# Altium schematic sheet BACKPMAN21_CPU.SchDoc
size A3
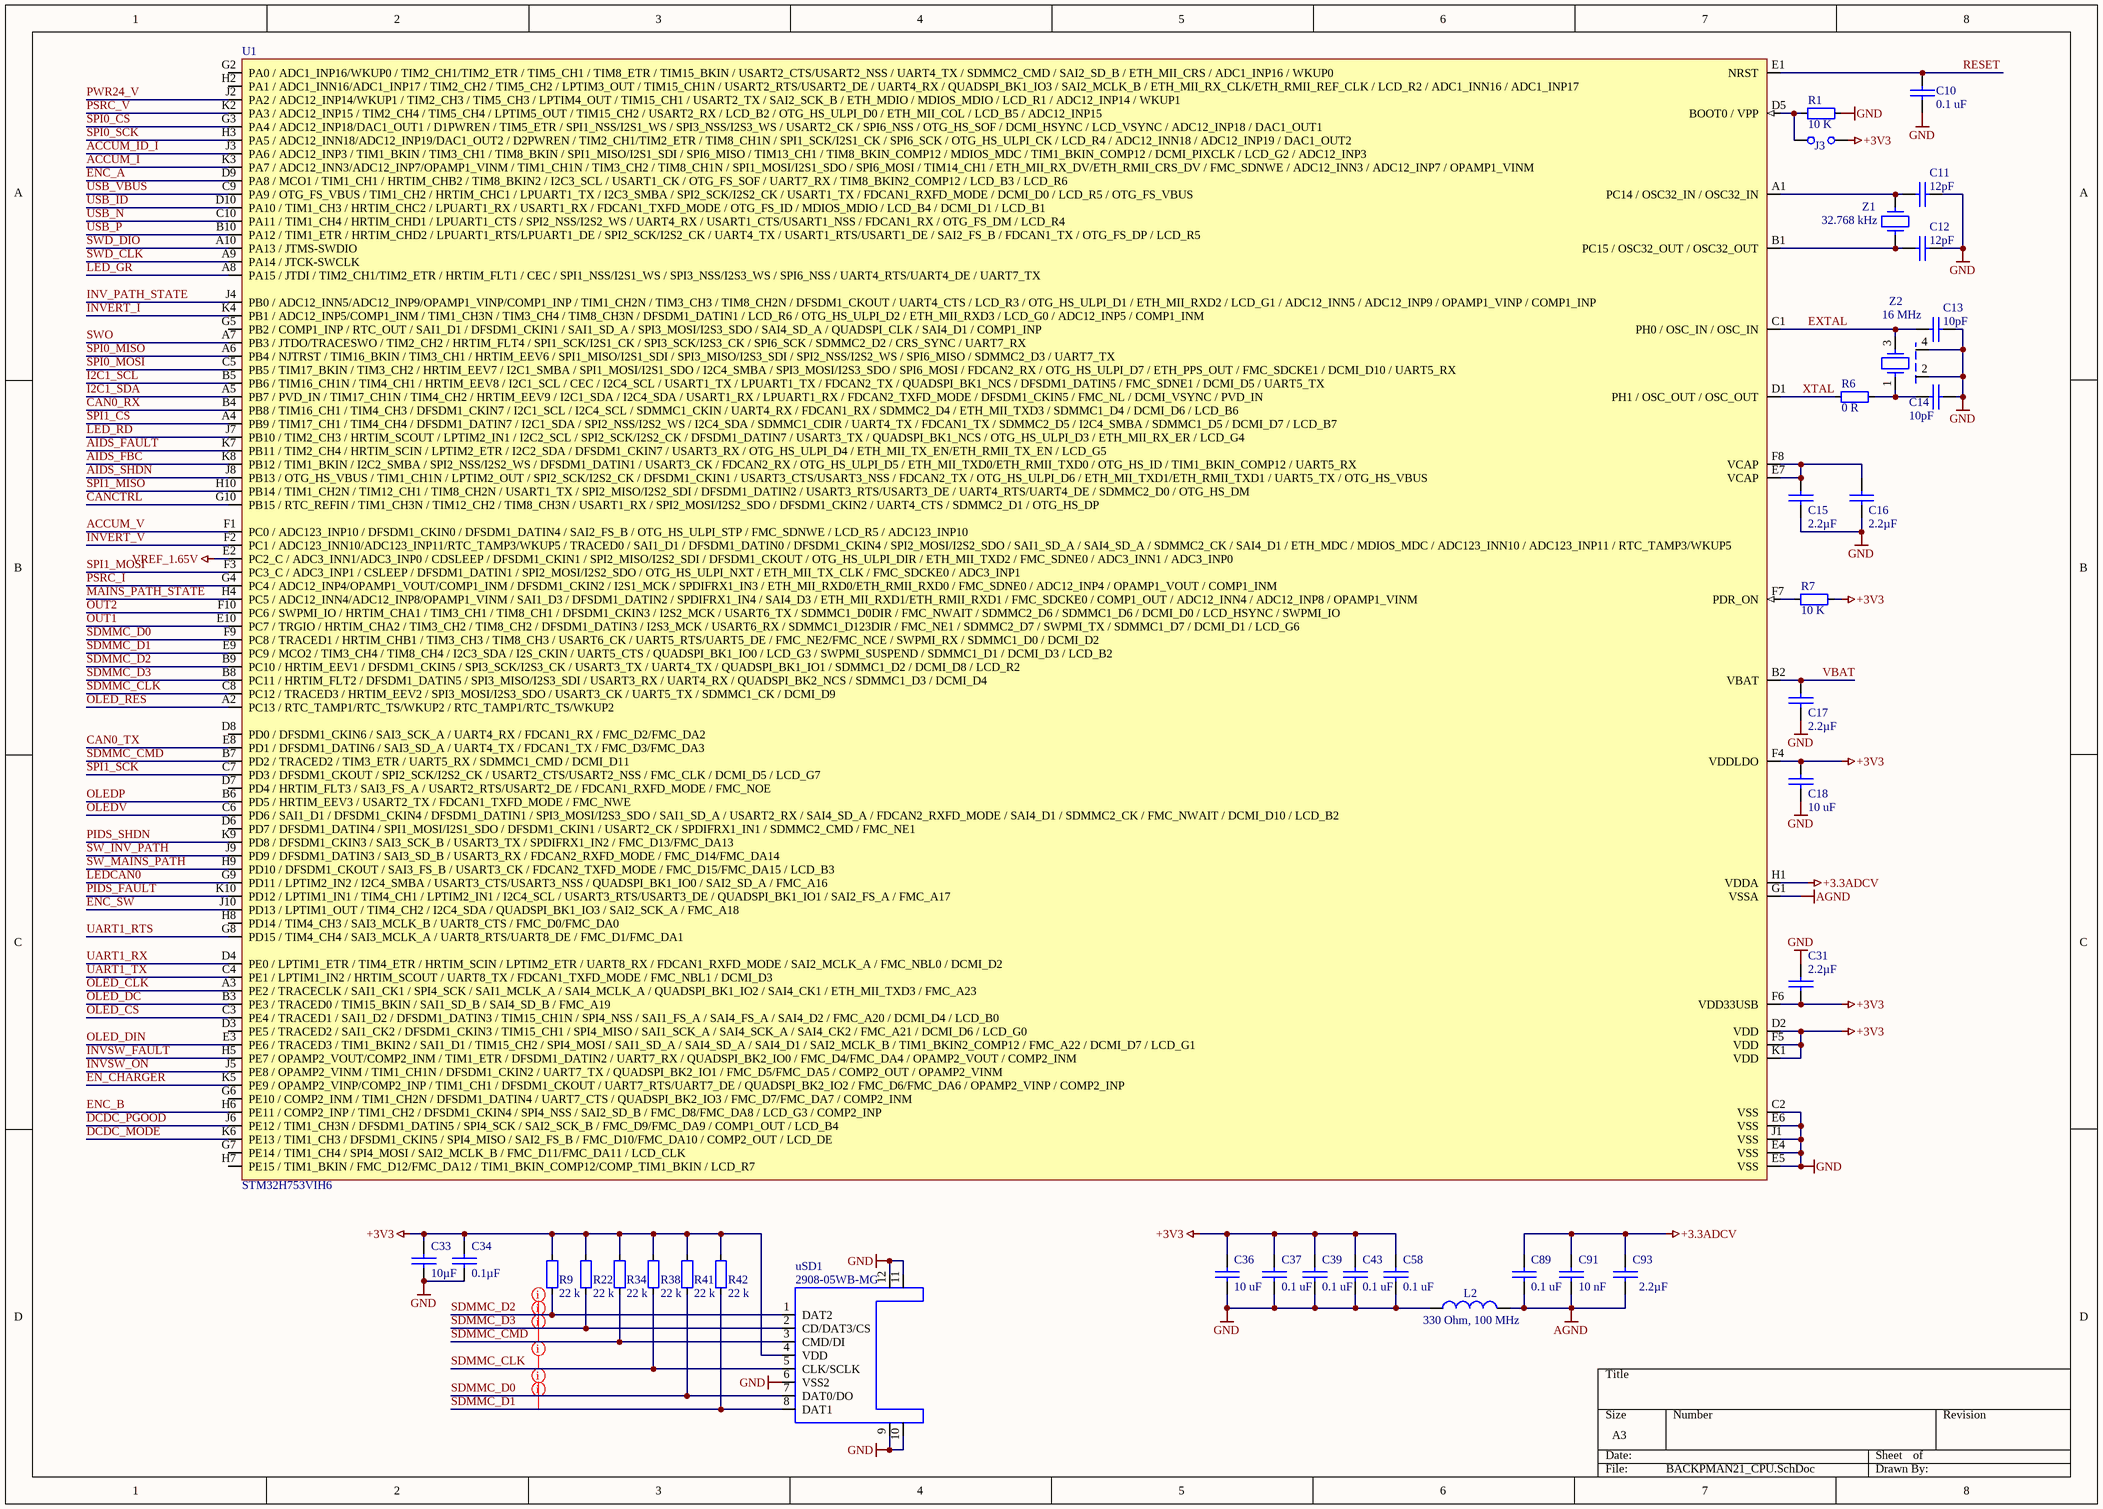
[diagram p0: BACKPMAN21_CPU.SchDoc]

## Parts
C10  value 0.1 uF  [1608[0603]]  (hidden comment: CL10B104KA8NNND)
C11  value 12pF  [0402 CAP]  (hidden comment: Capacitor)
C12  value 12pF  [0402 CAP]  (hidden comment: Capacitor)
C13  value 10pF  [0402 CAP]  (hidden comment: Capacitor)
C14  value 10pF  [0402 CAP]  (hidden comment: Capacitor)
C15  value 2.2µF  [0603 CAP]  (hidden comment: Capacitor)
C16  value 2.2µF  [0603 CAP]  (hidden comment: Capacitor)
C17  value 2.2µF  [0603 CAP]  (hidden comment: Capacitor)
C18  value 10 uF  [0805-1206]  (hidden comment: LMK212F106ZG-T)
C31  value 2.2µF  [0603 CAP]  (hidden comment: Capacitor)
C33  value 10µF  [0603 CAP]  (hidden comment: Capacitor)
C34  value 0.1µF  [0402 CAP]  (hidden comment: Capacitor)
C36  value 10 uF  [0805-1206]  (hidden comment: LMK212F106ZG-T)
C37  value 0.1 uF  [1608[0603]]  (hidden comment: CL10B104KA8NNND)
C39  value 0.1 uF  [1608[0603]]  (hidden comment: CL10B104KA8NNND)
C43  value 0.1 uF  [1608[0603]]  (hidden comment: CL10B104KA8NNND)
C58  value 0.1 uF  [1608[0603]]  (hidden comment: CL10B104KA8NNND)
C89  value 0.1 uF  [1608[0603]]  (hidden comment: CL10B104KA8NNND)
C91  value 10 nF  [1608[0603]]  (hidden comment: CVNF010K0603)
C93  value 2.2µF  [0603 CAP]  (hidden comment: Capacitor)
J3  PH1-02-TA-HT  [HDR1X2V]  (value not drawn)
L2  value 330 Ohm, 100 MHz  [0603]  (hidden comment: BLM18SG331TN1D)
R1  value 10 K  [0603]  (hidden comment: RL0603K010-1)
R6  value 0 R  [0603]  (hidden comment: RC0603FR-070RL)
R7  value 10 K  [0603]  (hidden comment: RL0603K010-1)
R9  value 22 k  [0402]  (hidden comment: Resistor)
R22  value 22 k  [0402]  (hidden comment: Resistor)
R34  value 22 k  [0402]  (hidden comment: Resistor)
R38  value 22 k  [0402]  (hidden comment: Resistor)
R41  value 22 k  [0402]  (hidden comment: Resistor)
R42  value 22 k  [0402]  (hidden comment: Resistor)
U1  STM32H753VIH6  [TFBGA100]
uSD1  2908-05WB-MG  [2908-05WB-MG]
Z1  value 32.768 kHz  [ABS7]  (hidden comment: ABS07-32.768KHZ-T)
Z2  value 16 MHz  [4-SMD 2.00mm x 1.60mm]  (hidden comment: ABM11-16.000MHZ-9-B1U-T)

## Nets
+3.3ADCV: C89.2 C91.1 C93.1 U1.H1(VDDA)
+3V3: C18.2 C31.2 C33.2 C34.2 C36.2 C37.2 C39.2 C43.2 C58.2 J3.2 R7.1 R9.2 R22.2 R34.2 R38.2 R41.2 R42.2 U1.D2(VDD) U1.F4(VDDLDO) U1.F5(VDD) U1.F6(VDD33USB) U1.K1(VDD) uSD1.4(VDD)
AGND: C89.1 C91.2 C93.2 L2.2 U1.G1(VSSA)
GND: C10.2 C11.2 C12.2 C13.2 C14.2 C15.2 C16.2 C17.2 C18.1 C31.1 C33.1 C34.1 C36.1 C37.1 C39.1 C43.1 C58.1 L2.1 R1.1 U1.C2(VSS) U1.E4(VSS) U1.E5(VSS) U1.E6(VSS) U1.J1(VSS) uSD1.6(VSS2) uSD1.9 uSD1.10(WP) uSD1.11(GND) uSD1.12(GND) Z2.2 Z2.4
VREF_1.65V: U1.E2(PC2_C_/_ADC3_INN1/ADC3_INP0_/_CDSLEEP_/_DFSDM1_CKIN1_/_SPI2_MISO/I2S2_SDI_/_DFSDM1_CKOUT_/_OTG_HS_ULPI_DIR_/_ETH_MII_TXD2_/_FMC_SDNE0_/_ADC3_INN1_/_ADC3_INP0)
ACCUM_I: U1.K3(PA7_/_ADC12_INN3/ADC12_INP7/OPAMP1_VINM_/_TIM1_CH1N_/_TIM3_CH2_/_TIM8_CH1N_/_SPI1_MOSI/I2S1_SDO_/_SPI6_MOSI_/_TIM14_CH1_/_ETH_MII_RX_DV/ETH_RMII_CRS_DV_/_FMC_SDNWE_/_ADC12_INN3_/_ADC12_INP7_/_OPAMP1_VINM)
ACCUM_ID_I: U1.J3(PA6_/_ADC12_INP3_/_TIM1_BKIN_/_TIM3_CH1_/_TIM8_BKIN_/_SPI1_MISO/I2S1_SDI_/_SPI6_MISO_/_TIM13_CH1_/_TIM8_BKIN_COMP12_/_MDIOS_MDC_/_TIM1_BKIN_COMP12_/_DCMI_PIXCLK_/_LCD_G2_/_ADC12_INP3)
ACCUM_V: U1.F1(PC0_/_ADC123_INP10_/_DFSDM1_CKIN0_/_DFSDM1_DATIN4_/_SAI2_FS_B_/_OTG_HS_ULPI_STP_/_FMC_SDNWE_/_LCD_R5_/_ADC123_INP10)
AIDS_FAULT: U1.K7(PB11_/_TIM2_CH4_/_HRTIM_SCIN_/_LPTIM2_ETR_/_I2C2_SDA_/_DFSDM1_CKIN7_/_USART3_RX_/_OTG_HS_ULPI_D4_/_ETH_MII_TX_EN/ETH_RMII_TX_EN_/_LCD_G5)
AIDS_FBC: U1.K8(PB12_/_TIM1_BKIN_/_I2C2_SMBA_/_SPI2_NSS/I2S2_WS_/_DFSDM1_DATIN1_/_USART3_CK_/_FDCAN2_RX_/_OTG_HS_ULPI_D5_/_ETH_MII_TXD0/ETH_RMII_TXD0_/_OTG_HS_ID_/_TIM1_BKIN_COMP12_/_UART5_RX)
AIDS_SHDN: U1.J8(PB13_/_OTG_HS_VBUS_/_TIM1_CH1N_/_LPTIM2_OUT_/_SPI2_SCK/I2S2_CK_/_DFSDM1_CKIN1_/_USART3_CTS/USART3_NSS_/_FDCAN2_TX_/_OTG_HS_ULPI_D6_/_ETH_MII_TXD1/ETH_RMII_TXD1_/_UART5_TX_/_OTG_HS_VBUS)
CAN0_RX: U1.B4(PB8_/_TIM16_CH1_/_TIM4_CH3_/_DFSDM1_CKIN7_/_I2C1_SCL_/_I2C4_SCL_/_SDMMC1_CKIN_/_UART4_RX_/_FDCAN1_RX_/_SDMMC2_D4_/_ETH_MII_TXD3_/_SDMMC1_D4_/_DCMI_D6_/_LCD_B6)
CAN0_TX: U1.E8(PD1_/_DFSDM1_DATIN6_/_SAI3_SD_A_/_UART4_TX_/_FDCAN1_TX_/_FMC_D3/FMC_DA3)
CANCTRL: U1.G10(PB15_/_RTC_REFIN_/_TIM1_CH3N_/_TIM12_CH2_/_TIM8_CH3N_/_USART1_RX_/_SPI2_MOSI/I2S2_SDO_/_DFSDM1_CKIN2_/_UART4_CTS_/_SDMMC2_D1_/_OTG_HS_DP)
DCDC_MODE: U1.K6(PE13_/_TIM1_CH3_/_DFSDM1_CKIN5_/_SPI4_MISO_/_SAI2_FS_B_/_FMC_D10/FMC_DA10_/_COMP2_OUT_/_LCD_DE)
DCDC_PGOOD: U1.J6(PE12_/_TIM1_CH3N_/_DFSDM1_DATIN5_/_SPI4_SCK_/_SAI2_SCK_B_/_FMC_D9/FMC_DA9_/_COMP1_OUT_/_LCD_B4)
EN_CHARGER: U1.K5(PE9_/_OPAMP2_VINP/COMP2_INP_/_TIM1_CH1_/_DFSDM1_CKOUT_/_UART7_RTS/UART7_DE_/_QUADSPI_BK2_IO2_/_FMC_D6/FMC_DA6_/_OPAMP2_VINP_/_COMP2_INP)
ENC_A: U1.D9(PA8_/_MCO1_/_TIM1_CH1_/_HRTIM_CHB2_/_TIM8_BKIN2_/_I2C3_SCL_/_USART1_CK_/_OTG_FS_SOF_/_UART7_RX_/_TIM8_BKIN2_COMP12_/_LCD_B3_/_LCD_R6)
ENC_B: U1.H6(PE11_/_COMP2_INP_/_TIM1_CH2_/_DFSDM1_CKIN4_/_SPI4_NSS_/_SAI2_SD_B_/_FMC_D8/FMC_DA8_/_LCD_G3_/_COMP2_INP)
ENC_SW: U1.J10(PD13_/_LPTIM1_OUT_/_TIM4_CH2_/_I2C4_SDA_/_QUADSPI_BK1_IO3_/_SAI2_SCK_A_/_FMC_A18)
EXTAL: C13.1 U1.C1(PH0_/_OSC_IN_/_OSC_IN) Z2.3
I2C1_SCL: U1.B5(PB6_/_TIM16_CH1N_/_TIM4_CH1_/_HRTIM_EEV8_/_I2C1_SCL_/_CEC_/_I2C4_SCL_/_USART1_TX_/_LPUART1_TX_/_FDCAN2_TX_/_QUADSPI_BK1_NCS_/_DFSDM1_DATIN5_/_FMC_SDNE1_/_DCMI_D5_/_UART5_TX)
I2C1_SDA: U1.A5(PB7_/_PVD_IN_/_TIM17_CH1N_/_TIM4_CH2_/_HRTIM_EEV9_/_I2C1_SDA_/_I2C4_SDA_/_USART1_RX_/_LPUART1_RX_/_FDCAN2_TXFD_MODE_/_DFSDM1_CKIN5_/_FMC_NL_/_DCMI_VSYNC_/_PVD_IN)
INV_PATH_STATE: U1.J4(PB0_/_ADC12_INN5/ADC12_INP9/OPAMP1_VINP/COMP1_INP_/_TIM1_CH2N_/_TIM3_CH3_/_TIM8_CH2N_/_DFSDM1_CKOUT_/_UART4_CTS_/_LCD_R3_/_OTG_HS_ULPI_D1_/_ETH_MII_RXD2_/_LCD_G1_/_ADC12_INN5_/_ADC12_INP9_/_OPAMP1_VINP_/_COMP1_INP)
INVERT_I: U1.K4(PB1_/_ADC12_INP5/COMP1_INM_/_TIM1_CH3N_/_TIM3_CH4_/_TIM8_CH3N_/_DFSDM1_DATIN1_/_LCD_R6_/_OTG_HS_ULPI_D2_/_ETH_MII_RXD3_/_LCD_G0_/_ADC12_INP5_/_COMP1_INM)
INVERT_V: U1.F2(PC1_/_ADC123_INN10/ADC123_INP11/RTC_TAMP3/WKUP5_/_TRACED0_/_SAI1_D1_/_DFSDM1_DATIN0_/_DFSDM1_CKIN4_/_SPI2_MOSI/I2S2_SDO_/_SAI1_SD_A_/_SAI4_SD_A_/_SDMMC2_CK_/_SAI4_D1_/_ETH_MDC_/_MDIOS_MDC_/_ADC123_INN10_/_ADC123_INP11_/_RTC_TAMP3/WKUP5)
INVSW_FAULT: U1.H5(PE7_/_OPAMP2_VOUT/COMP2_INM_/_TIM1_ETR_/_DFSDM1_DATIN2_/_UART7_RX_/_QUADSPI_BK2_IO0_/_FMC_D4/FMC_DA4_/_OPAMP2_VOUT_/_COMP2_INM)
INVSW_ON: U1.J5(PE8_/_OPAMP2_VINM_/_TIM1_CH1N_/_DFSDM1_CKIN2_/_UART7_TX_/_QUADSPI_BK2_IO1_/_FMC_D5/FMC_DA5_/_COMP2_OUT_/_OPAMP2_VINM)
LED_GR: U1.A8(PA15_/_JTDI_/_TIM2_CH1/TIM2_ETR_/_HRTIM_FLT1_/_CEC_/_SPI1_NSS/I2S1_WS_/_SPI3_NSS/I2S3_WS_/_SPI6_NSS_/_UART4_RTS/UART4_DE_/_UART7_TX)
LED_RD: U1.J7(PB10_/_TIM2_CH3_/_HRTIM_SCOUT_/_LPTIM2_IN1_/_I2C2_SCL_/_SPI2_SCK/I2S2_CK_/_DFSDM1_DATIN7_/_USART3_TX_/_QUADSPI_BK1_NCS_/_OTG_HS_ULPI_D3_/_ETH_MII_RX_ER_/_LCD_G4)
LEDCAN0: U1.G9(PD11_/_LPTIM2_IN2_/_I2C4_SMBA_/_USART3_CTS/USART3_NSS_/_QUADSPI_BK1_IO0_/_SAI2_SD_A_/_FMC_A16)
MAINS_PATH_STATE: U1.H4(PC5_/_ADC12_INN4/ADC12_INP8/OPAMP1_VINM_/_SAI1_D3_/_DFSDM1_DATIN2_/_SPDIFRX1_IN4_/_SAI4_D3_/_ETH_MII_RXD1/ETH_RMII_RXD1_/_FMC_SDCKE0_/_COMP1_OUT_/_ADC12_INN4_/_ADC12_INP8_/_OPAMP1_VINM)
OLED_CLK: U1.A3(PE2_/_TRACECLK_/_SAI1_CK1_/_SPI4_SCK_/_SAI1_MCLK_A_/_SAI4_MCLK_A_/_QUADSPI_BK1_IO2_/_SAI4_CK1_/_ETH_MII_TXD3_/_FMC_A23)
OLED_CS: U1.C3(PE4_/_TRACED1_/_SAI1_D2_/_DFSDM1_DATIN3_/_TIM15_CH1N_/_SPI4_NSS_/_SAI1_FS_A_/_SAI4_FS_A_/_SAI4_D2_/_FMC_A20_/_DCMI_D4_/_LCD_B0)
OLED_DC: U1.B3(PE3_/_TRACED0_/_TIM15_BKIN_/_SAI1_SD_B_/_SAI4_SD_B_/_FMC_A19)
OLED_DIN: U1.E3(PE6_/_TRACED3_/_TIM1_BKIN2_/_SAI1_D1_/_TIM15_CH2_/_SPI4_MOSI_/_SAI1_SD_A_/_SAI4_SD_A_/_SAI4_D1_/_SAI2_MCLK_B_/_TIM1_BKIN2_COMP12_/_FMC_A22_/_DCMI_D7_/_LCD_G1)
OLED_RES: U1.A2(PC13_/_RTC_TAMP1/RTC_TS/WKUP2_/_RTC_TAMP1/RTC_TS/WKUP2)
OLEDP: U1.B6(PD5_/_HRTIM_EEV3_/_USART2_TX_/_FDCAN1_TXFD_MODE_/_FMC_NWE)
OLEDV: U1.C6(PD6_/_SAI1_D1_/_DFSDM1_CKIN4_/_DFSDM1_DATIN1_/_SPI3_MOSI/I2S3_SDO_/_SAI1_SD_A_/_USART2_RX_/_SAI4_SD_A_/_FDCAN2_RXFD_MODE_/_SAI4_D1_/_SDMMC2_CK_/_FMC_NWAIT_/_DCMI_D10_/_LCD_B2)
OUT1: U1.E10(PC7_/_TRGIO_/_HRTIM_CHA2_/_TIM3_CH2_/_TIM8_CH2_/_DFSDM1_DATIN3_/_I2S3_MCK_/_USART6_RX_/_SDMMC1_D123DIR_/_FMC_NE1_/_SDMMC2_D7_/_SWPMI_TX_/_SDMMC1_D7_/_DCMI_D1_/_LCD_G6)
OUT2: U1.F10(PC6_/_SWPMI_IO_/_HRTIM_CHA1_/_TIM3_CH1_/_TIM8_CH1_/_DFSDM1_CKIN3_/_I2S2_MCK_/_USART6_TX_/_SDMMC1_D0DIR_/_FMC_NWAIT_/_SDMMC2_D6_/_SDMMC1_D6_/_DCMI_D0_/_LCD_HSYNC_/_SWPMI_IO)
PIDS_FAULT: U1.K10(PD12_/_LPTIM1_IN1_/_TIM4_CH1_/_LPTIM2_IN1_/_I2C4_SCL_/_USART3_RTS/USART3_DE_/_QUADSPI_BK1_IO1_/_SAI2_FS_A_/_FMC_A17)
PIDS_SHDN: U1.K9(PD8_/_DFSDM1_CKIN3_/_SAI3_SCK_B_/_USART3_TX_/_SPDIFRX1_IN2_/_FMC_D13/FMC_DA13)
PSRC_I: U1.G4(PC4_/_ADC12_INP4/OPAMP1_VOUT/COMP1_INM_/_DFSDM1_CKIN2_/_I2S1_MCK_/_SPDIFRX1_IN3_/_ETH_MII_RXD0/ETH_RMII_RXD0_/_FMC_SDNE0_/_ADC12_INP4_/_OPAMP1_VOUT_/_COMP1_INM)
PSRC_V: U1.K2(PA3_/_ADC12_INP15_/_TIM2_CH4_/_TIM5_CH4_/_LPTIM5_OUT_/_TIM15_CH2_/_USART2_RX_/_LCD_B2_/_OTG_HS_ULPI_D0_/_ETH_MII_COL_/_LCD_B5_/_ADC12_INP15)
PWR24_V: U1.J2(PA2_/_ADC12_INP14/WKUP1_/_TIM2_CH3_/_TIM5_CH3_/_LPTIM4_OUT_/_TIM15_CH1_/_USART2_TX_/_SAI2_SCK_B_/_ETH_MDIO_/_MDIOS_MDIO_/_LCD_R1_/_ADC12_INP14_/_WKUP1)
RESET: C10.1 U1.E1(NRST)
SDMMC_CLK: R38.1 U1.C8(PC12_/_TRACED3_/_HRTIM_EEV2_/_SPI3_MOSI/I2S3_SDO_/_USART3_CK_/_UART5_TX_/_SDMMC1_CK_/_DCMI_D9) uSD1.5(CLK/SCLK)
SDMMC_CMD: R34.1 U1.B7(PD2_/_TRACED2_/_TIM3_ETR_/_UART5_RX_/_SDMMC1_CMD_/_DCMI_D11) uSD1.3(CMD/DI)
SDMMC_D0: R41.1 U1.F9(PC8_/_TRACED1_/_HRTIM_CHB1_/_TIM3_CH3_/_TIM8_CH3_/_USART6_CK_/_UART5_RTS/UART5_DE_/_FMC_NE2/FMC_NCE_/_SWPMI_RX_/_SDMMC1_D0_/_DCMI_D2) uSD1.7(DAT0/DO)
SDMMC_D1: R42.1 U1.E9(PC9_/_MCO2_/_TIM3_CH4_/_TIM8_CH4_/_I2C3_SDA_/_I2S_CKIN_/_UART5_CTS_/_QUADSPI_BK1_IO0_/_LCD_G3_/_SWPMI_SUSPEND_/_SDMMC1_D1_/_DCMI_D3_/_LCD_B2) uSD1.8(DAT1)
SDMMC_D2: R9.1 U1.B9(PC10_/_HRTIM_EEV1_/_DFSDM1_CKIN5_/_SPI3_SCK/I2S3_CK_/_USART3_TX_/_UART4_TX_/_QUADSPI_BK1_IO1_/_SDMMC1_D2_/_DCMI_D8_/_LCD_R2) uSD1.1(DAT2)
SDMMC_D3: R22.1 U1.B8(PC11_/_HRTIM_FLT2_/_DFSDM1_DATIN5_/_SPI3_MISO/I2S3_SDI_/_USART3_RX_/_UART4_RX_/_QUADSPI_BK2_NCS_/_SDMMC1_D3_/_DCMI_D4) uSD1.2(CD/DAT3/CS)
SPI0_CS: U1.G3(PA4_/_ADC12_INP18/DAC1_OUT1_/_D1PWREN_/_TIM5_ETR_/_SPI1_NSS/I2S1_WS_/_SPI3_NSS/I2S3_WS_/_USART2_CK_/_SPI6_NSS_/_OTG_HS_SOF_/_DCMI_HSYNC_/_LCD_VSYNC_/_ADC12_INP18_/_DAC1_OUT1)
SPI0_MISO: U1.A6(PB4_/_NJTRST_/_TIM16_BKIN_/_TIM3_CH1_/_HRTIM_EEV6_/_SPI1_MISO/I2S1_SDI_/_SPI3_MISO/I2S3_SDI_/_SPI2_NSS/I2S2_WS_/_SPI6_MISO_/_SDMMC2_D3_/_UART7_TX)
SPI0_MOSI: U1.C5(PB5_/_TIM17_BKIN_/_TIM3_CH2_/_HRTIM_EEV7_/_I2C1_SMBA_/_SPI1_MOSI/I2S1_SDO_/_I2C4_SMBA_/_SPI3_MOSI/I2S3_SDO_/_SPI6_MOSI_/_FDCAN2_RX_/_OTG_HS_ULPI_D7_/_ETH_PPS_OUT_/_FMC_SDCKE1_/_DCMI_D10_/_UART5_RX)
SPI0_SCK: U1.H3(PA5_/_ADC12_INN18/ADC12_INP19/DAC1_OUT2_/_D2PWREN_/_TIM2_CH1/TIM2_ETR_/_TIM8_CH1N_/_SPI1_SCK/I2S1_CK_/_SPI6_SCK_/_OTG_HS_ULPI_CK_/_LCD_R4_/_ADC12_INN18_/_ADC12_INP19_/_DAC1_OUT2)
SPI1_CS: U1.A4(PB9_/_TIM17_CH1_/_TIM4_CH4_/_DFSDM1_DATIN7_/_I2C1_SDA_/_SPI2_NSS/I2S2_WS_/_I2C4_SDA_/_SDMMC1_CDIR_/_UART4_TX_/_FDCAN1_TX_/_SDMMC2_D5_/_I2C4_SMBA_/_SDMMC1_D5_/_DCMI_D7_/_LCD_B7)
SPI1_MISO: U1.H10(PB14_/_TIM1_CH2N_/_TIM12_CH1_/_TIM8_CH2N_/_USART1_TX_/_SPI2_MISO/I2S2_SDI_/_DFSDM1_DATIN2_/_USART3_RTS/USART3_DE_/_UART4_RTS/UART4_DE_/_SDMMC2_D0_/_OTG_HS_DM)
SPI1_MOSI: U1.F3(PC3_C_/_ADC3_INP1_/_CSLEEP_/_DFSDM1_DATIN1_/_SPI2_MOSI/I2S2_SDO_/_OTG_HS_ULPI_NXT_/_ETH_MII_TX_CLK_/_FMC_SDCKE0_/_ADC3_INP1)
SPI1_SCK: U1.C7(PD3_/_DFSDM1_CKOUT_/_SPI2_SCK/I2S2_CK_/_USART2_CTS/USART2_NSS_/_FMC_CLK_/_DCMI_D5_/_LCD_G7)
SW_INV_PATH: U1.J9(PD9_/_DFSDM1_DATIN3_/_SAI3_SD_B_/_USART3_RX_/_FDCAN2_RXFD_MODE_/_FMC_D14/FMC_DA14)
SW_MAINS_PATH: U1.H9(PD10_/_DFSDM1_CKOUT_/_SAI3_FS_B_/_USART3_CK_/_FDCAN2_TXFD_MODE_/_FMC_D15/FMC_DA15_/_LCD_B3)
SWD_CLK: U1.A9(PA14_/_JTCK-SWCLK)
SWD_DIO: U1.A10(PA13_/_JTMS-SWDIO)
SWO: U1.A7(PB3_/_JTDO/TRACESWO_/_TIM2_CH2_/_HRTIM_FLT4_/_SPI1_SCK/I2S1_CK_/_SPI3_SCK/I2S3_CK_/_SPI6_SCK_/_SDMMC2_D2_/_CRS_SYNC_/_UART7_RX)
UART1_RTS: U1.G8(PD15_/_TIM4_CH4_/_SAI3_MCLK_A_/_UART8_RTS/UART8_DE_/_FMC_D1/FMC_DA1)
UART1_RX: U1.D4(PE0_/_LPTIM1_ETR_/_TIM4_ETR_/_HRTIM_SCIN_/_LPTIM2_ETR_/_UART8_RX_/_FDCAN1_RXFD_MODE_/_SAI2_MCLK_A_/_FMC_NBL0_/_DCMI_D2)
UART1_TX: U1.C4(PE1_/_LPTIM1_IN2_/_HRTIM_SCOUT_/_UART8_TX_/_FDCAN1_TXFD_MODE_/_FMC_NBL1_/_DCMI_D3)
USB_ID: U1.D10(PA10_/_TIM1_CH3_/_HRTIM_CHC2_/_LPUART1_RX_/_USART1_RX_/_FDCAN1_TXFD_MODE_/_OTG_FS_ID_/_MDIOS_MDIO_/_LCD_B4_/_DCMI_D1_/_LCD_B1)
USB_N: U1.C10(PA11_/_TIM1_CH4_/_HRTIM_CHD1_/_LPUART1_CTS_/_SPI2_NSS/I2S2_WS_/_UART4_RX_/_USART1_CTS/USART1_NSS_/_FDCAN1_RX_/_OTG_FS_DM_/_LCD_R4)
USB_P: U1.B10(PA12_/_TIM1_ETR_/_HRTIM_CHD2_/_LPUART1_RTS/LPUART1_DE_/_SPI2_SCK/I2S2_CK_/_UART4_TX_/_USART1_RTS/USART1_DE_/_SAI2_FS_B_/_FDCAN1_TX_/_OTG_FS_DP_/_LCD_R5)
USB_VBUS: U1.C9(PA9_/_OTG_FS_VBUS_/_TIM1_CH2_/_HRTIM_CHC1_/_LPUART1_TX_/_I2C3_SMBA_/_SPI2_SCK/I2S2_CK_/_USART1_TX_/_FDCAN1_RXFD_MODE_/_DCMI_D0_/_LCD_R5_/_OTG_FS_VBUS)
VBAT: C17.1 U1.B2(VBAT)
XTAL: R6.2 U1.D1(PH1_/_OSC_OUT_/_OSC_OUT)
NetC11_1: C11.1 U1.A1(PC14_/_OSC32_IN_/_OSC32_IN) Z1.2
NetC12_1: C12.1 U1.B1(PC15_/_OSC32_OUT_/_OSC32_OUT) Z1.1
NetC14_1: C14.1 R6.1 Z2.1
NetC15_1: C15.1 C16.1 U1.E7(VCAP) U1.F8(VCAP)
NetJ3_1: J3.1 R1.2 U1.D5(BOOT0_/_VPP)
NetR7_2: R7.2 U1.F7(PDR_ON)

Not connected (* = marked no-connect by the designer): U1 D3(PE5_/_TRACED2_/_SAI1_CK2_/_DFSDM1_CKIN3_/_TIM15_CH1_/_SPI4_MISO_/_SAI1_SCK_A_/_SAI4_SCK_A_/_SAI4_CK2_/_FMC_A21_/_DCMI_D6_/_LCD_G0) D6(PD7_/_DFSDM1_DATIN4_/_SPI1_MOSI/I2S1_SDO_/_DFSDM1_CKIN1_/_USART2_CK_/_SPDIFRX1_IN1_/_SDMMC2_CMD_/_FMC_NE1) D7(PD4_/_HRTIM_FLT3_/_SAI3_FS_A_/_USART2_RTS/USART2_DE_/_FDCAN1_RXFD_MODE_/_FMC_NOE) D8(PD0_/_DFSDM1_CKIN6_/_SAI3_SCK_A_/_UART4_RX_/_FDCAN1_RX_/_FMC_D2/FMC_DA2) G2(PA0_/_ADC1_INP16/WKUP0_/_TIM2_CH1/TIM2_ETR_/_TIM5_CH1_/_TIM8_ETR_/_TIM15_BKIN_/_USART2_CTS/USART2_NSS_/_UART4_TX_/_SDMMC2_CMD_/_SAI2_SD_B_/_ETH_MII_CRS_/_ADC1_INP16_/_WKUP0) G5(PB2_/_COMP1_INP_/_RTC_OUT_/_SAI1_D1_/_DFSDM1_CKIN1_/_SAI1_SD_A_/_SPI3_MOSI/I2S3_SDO_/_SAI4_SD_A_/_QUADSPI_CLK_/_SAI4_D1_/_COMP1_INP) G6(PE10_/_COMP2_INM_/_TIM1_CH2N_/_DFSDM1_DATIN4_/_UART7_CTS_/_QUADSPI_BK2_IO3_/_FMC_D7/FMC_DA7_/_COMP2_INM) G7(PE14_/_TIM1_CH4_/_SPI4_MOSI_/_SAI2_MCLK_B_/_FMC_D11/FMC_DA11_/_LCD_CLK) H2(PA1_/_ADC1_INN16/ADC1_INP17_/_TIM2_CH2_/_TIM5_CH2_/_LPTIM3_OUT_/_TIM15_CH1N_/_USART2_RTS/USART2_DE_/_UART4_RX_/_QUADSPI_BK1_IO3_/_SAI2_MCLK_B_/_ETH_MII_RX_CLK/ETH_RMII_REF_CLK_/_LCD_R2_/_ADC1_INN16_/_ADC1_INP17) H7(PE15_/_TIM1_BKIN_/_FMC_D12/FMC_DA12_/_TIM1_BKIN_COMP12/COMP_TIM1_BKIN_/_LCD_R7) H8(PD14_/_TIM4_CH3_/_SAI3_MCLK_B_/_UART8_CTS_/_FMC_D0/FMC_DA0)

## Layout directives
net class uSD: SDMMC_CLK, SDMMC_CMD, SDMMC_D0, SDMMC_D1, SDMMC_D2, SDMMC_D3

## Library data of the parts
C10 C37 C39 C43 C58 C89 = CVNF100K0603-25: 0.1 uF, 50V, 10% , X7R,  0603 SMD MLC Capacitor; Manufacturer: WALSIN; PartNum: 2496834; PartName: 0603B104K500CT; Tolerance: ±10%; Distributor: Farnell; Voltage: 50 V
C11 C12 = 0402N120G500CT: 12pF, ±2%, 50V, C0G, NP0, 0402 (1005 Metric), -55°C ~ 125°C, -, General Purpose; Manufacturer: Walsin Technology Corporation; PartNum: 1292-1250-1-ND; Voltage - Rated: 50V; Part Number: 0402N120G500CT; Distributor: Digi-Key; PartName: 0402N120G500CT; Price: 0.10000; Tolerance: ±2%; Temperature Coefficient: C0G, NP0; Operating Temperature: -55°C ~ 125°C; Features: -; Package / Case: 0402 (1005 Metric)
C13 C14 = GCM1555C1H100FA16D: 10pF, ±1%, 50V, C0G, NP0, 0402 (1005 Metric), -55°C ~ 125°C, -, Automotive; Manufacturer: Murata Electronics North America; PartNum: 490-14348-1-ND; Voltage - Rated: 50V; Part Number: GCM1555C1H100FA16D; Distributor: Digi-Key; PartName: GCM1555C1H100FA16D; Price: 0.15000; Tolerance: ±1%; Temperature Coefficient: C0G, NP0; Operating Temperature: -55°C ~ 125°C; Features: -; Package / Case: 0402 (1005 Metric)
C15-C17 C31 C93 = CC0603KRX5R7BB225: 2.2µF, ±10%, 16V, X5R, 0603 (1608 Metric), -55°C ~ 85°C, -, General Purpose; Manufacturer: Yageo; PartNum: 311-1784-1-ND; Part Number: CC0603KRX5R7BB225; Distributor: Digi-Key; PartName: CC0603KRX5R7BB225; Price: 0.07420; Tolerance: ±10%; Voltage - Rated: 16V; Temperature Coefficient: X5R; Operating Temperature: -55°C ~ 85°C; Features: -; Package / Case: 0603 (1608 Metric)
C18 C36 = LMK212F106ZG-T: CAP CER 10UF 10V 10% X5R 0805; Manufacturer: Taiyo Yuden; PartNum: 587-2668-1-ND; PartName: LMK212B7106KG-TD; Distributor: Digi-Key; Price: 0.102$; Tolerance: 10%; Voltage: 10V
C33 = GRT188R61C106KE13D: 10µF, ±10%, 16V, X5R, 0603 (1608 Metric), -55°C ~ 85°C, -, Automotive; Manufacturer: Murata Electronics North America; PartNum: 490-12317-1-ND; Voltage - Rated: 16V; Part Number: GRT188R61C106KE13D; Distributor: Digi-Key; PartName: GRT188R61C106KE13D; Price: 0.22770; Tolerance: ±10%; Temperature Coefficient: X5R; Operating Temperature: -55°C ~ 85°C; Features: -; Package / Case: 0603 (1608 Metric)
C34 = 0402B104K500CT: 0.1µF, ±10%, 50V, X7R, 0402 (1005 Metric), -55°C ~ 125°C, -, General Purpose; Manufacturer: Walsin Technology Corporation; PartNum: 1292-1176-1-ND; Voltage - Rated: 50V; Part Number: 0402B104K500CT; Distributor: Digi-Key; PartName: 0402B104K500CT; Price: 0.19000; Tolerance: ±10%; Temperature Coefficient: X7R; Operating Temperature: -55°C ~ 125°C; Features: -; Package / Case: 0402 (1005 Metric)
C91 = CVNF010K0603: 10 nF, 50V, 10%, X7R, 0603 SMD MLC Capacitor; Manufacturer: Murata Electronics; PartNum: 490-1512-1-ND; PartName: GRM188R71H103KA01D; Tolerance: ±10%; Distributor: Digi-Key; Voltage: 50 V
J3 = Jumper: 2 Pos. 2.54 mm Single Row Through Hole Straight Pin Header; Manufacturer: ADAM TECH; Distributor: Future; Price: 0.02 Euro; PartNum: PH1-02-TA-HT; PartName: PH1-02-TA-HT; Price50: 0.02 Euro; Price100: 0.02 Euro; Price1000: 0.02 Euro
L2 = BLM18SG331TN1D: Ferrite bead, 330 Ohm, 100 MHz,  1.5 A, 0.07 Ohm; Manufacturer: Murata Electronics North America; Tolerance: 25%; Distributor: Future; Price: 0.03 Euro; PartNum: BLM18SG331TN1D; PartName: BLM18SG331TN1D
R1 R7 = RL0603K010-1: 10 K, 1%, 0603, SMD Resistor, Taped; Manufacturer: Vishay; Voltage: 75 V; Distributor: Schukat; Price: 0.002 Euro; Tolerance: 1%; PartNum: RL0603K010-1
R6 = RC0603FR-070RL: 0 R, Jumper, 0603, SMD Resistor, -55°C ~ 155°C; Manufacturer: Yageo; PartNum: 311-0.0HRCT-ND; Voltage: 75 V; Distributor: Digi-Key; Price: 0.005$; PartName: RC0603FR-070RL
R9 R22 R34 R38 R41 R42 = RMCF0402FT22K0: 22 kOhms, ±1%, 0.063W, 1/16W, Thick Film, ±100ppm/°C, 0402 (1005 Metric), -55°C ~ 155°C, Automotive AEC-Q200; Manufacturer: Stackpole Electronics Inc; PartNum: RMCF0402FT22K0CT-ND; Voltage: 75V; Distributor: Digi-Key; Price: 0.10000; Tolerance: ±1%; PartName: RMCF0402FT22K0; Part Number: RMCF0402FT22K0; Temperature Coefficient: ±100ppm/°C; Operating Temperature: -55°C ~ 155°C; Power (Watts): 0.063W, 1/16W; Features: Automotive AEC-Q200; Package / Case: 0402 (1005 Metric)
U1 = STM32H753VIH6: Cortex-M7, 480MHz 2MB FLASH, 1MB RAM, 100-TFBGA (8x8); Manufacturer: STMicroelectronics; PartNum: STM32H753VIH6-ND; Distributor: Digi-Key; PartName: STM32H753VIH6; Price: 9.89$
uSD1 = 2908-05WB-MG: microSD cadr holder; Manufacturer: 3M; Price: 2.71$; Distributor: Farnell; PartNum: 2908-05WB-MG; PartName: 2908-05WB-MG
Z1 = ABS07-32.768KHZ-T: 32.768 kHz, 12.5 pF, 70 kOhm, ±20ppm, 3.2 x 1.5 mm, -40°C ~ 85°C; Manufacturer: Abracon Corporation; PartNum: 535-9542-1-ND; Price: 1.09$; Distributor: Digi-Key; Tolerance: 20 ppm; PartName: ABS07-32.768KHZ-T
Z2 = ABM11-16.000MHZ-9-B1U-T: 16 MHz, 9 pF, ±10ppm, 2.00mm x 1.60mm, -20°C ~ 70°C; Manufacturer: Abracon LLC; PartNum: 535-13598-1-ND; Price: 0.98 $; Distributor: Digi-Key; Tolerance: 10 ppm; PartName: ABM11-16.000MHZ-9-B1U-T; Supplier 1: Digi-Key; Supplier Part Number 1: 535-13598-2-ND